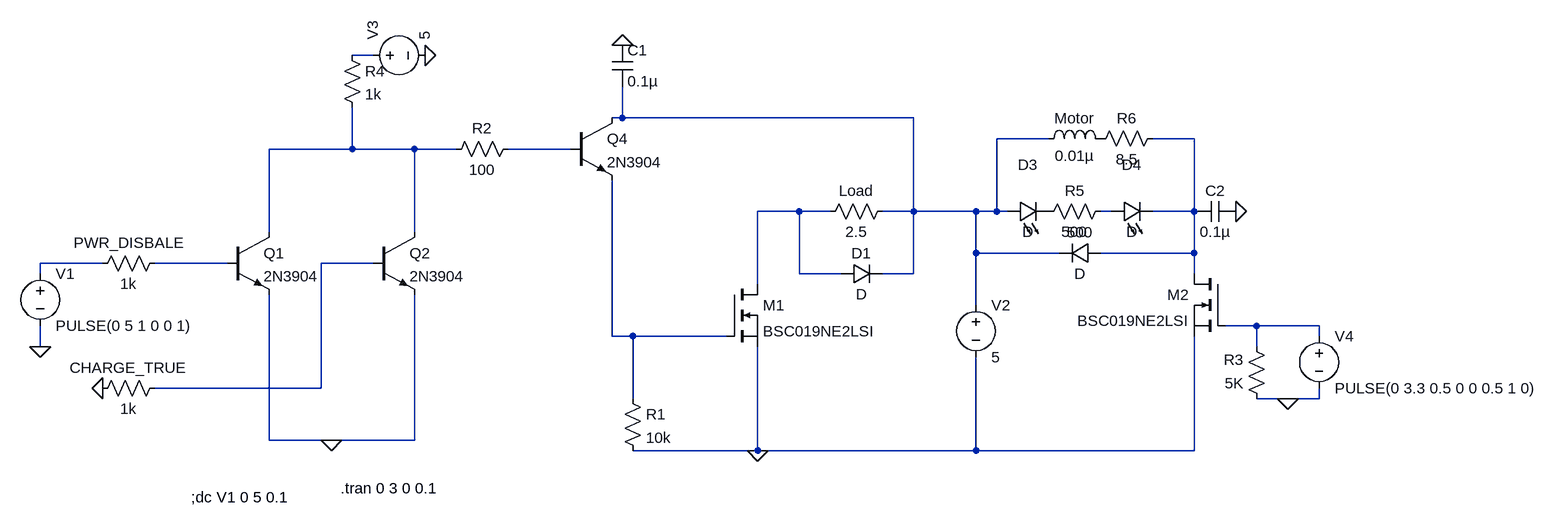
[diagram p0: schematic Control system simulation.asc]
Control system simulation.asc, the LTspice schematic file:
Version 4
SHEET 1 24240 680
WIRE -80 -416 -112 -416
WIRE 304 -320 304 -368
WIRE 304 -320 288 -320
WIRE 752 -320 304 -320
WIRE 960 -288 880 -288
WIRE 1184 -288 1120 -288
WIRE -112 -272 -112 -336
WIRE -112 -272 -240 -272
WIRE -16 -272 -112 -272
WIRE 48 -272 -16 -272
WIRE 224 -272 128 -272
WIRE 576 -176 512 -176
WIRE 624 -176 576 -176
WIRE 752 -176 752 -320
WIRE 752 -176 704 -176
WIRE 848 -176 752 -176
WIRE 880 -176 880 -288
WIRE 880 -176 848 -176
WIRE 896 -176 880 -176
WIRE 1056 -176 1040 -176
WIRE 1184 -176 1184 -288
WIRE 1184 -176 1120 -176
WIRE -240 -144 -240 -272
WIRE -16 -144 -16 -272
WIRE 848 -112 848 -176
WIRE 976 -112 848 -112
WIRE 1184 -112 1184 -176
WIRE 1184 -112 1040 -112
WIRE -496 -96 -592 -96
WIRE -304 -96 -416 -96
WIRE -80 -96 -160 -96
WIRE -592 -80 -592 -96
WIRE 576 -80 576 -176
WIRE 640 -80 576 -80
WIRE 752 -80 752 -176
WIRE 752 -80 704 -80
WIRE 1184 -80 1184 -112
WIRE 512 -64 512 -176
WIRE 848 -32 848 -112
WIRE 1280 0 1232 0
WIRE 1376 0 1280 0
WIRE 288 16 288 -224
WIRE 320 16 288 16
WIRE 464 16 320 16
WIRE 1376 16 1376 0
WIRE -592 32 -592 0
WIRE 1280 32 1280 0
WIRE -160 96 -160 -96
WIRE -160 96 -416 96
WIRE 320 112 320 16
WIRE 1328 112 1280 112
WIRE 1376 112 1376 96
WIRE 1376 112 1328 112
WIRE -240 176 -240 -48
WIRE -144 176 -240 176
WIRE -16 176 -16 -48
WIRE -16 176 -144 176
WIRE 512 192 512 32
WIRE 512 192 320 192
WIRE 848 192 848 48
WIRE 848 192 512 192
WIRE 1184 192 1184 16
WIRE 1184 192 848 192
FLAG 512 192 0
FLAG 304 -432 0
FLAG -144 176 0
FLAG 0 -416 0
FLAG -496 96 0
FLAG -592 32 0
FLAG 1248 -176 0
FLAG 1328 112 0
SYMBOL nmos 464 -64 R0
SYMATTR InstName M1
SYMATTR Value BSC019NE2LSI
SYMBOL voltage 848 -48 R0
WINDOW 123 0 0 Left 0
WINDOW 39 0 0 Left 0
SYMATTR InstName V2
SYMATTR Value 5
SYMBOL res 720 -192 R90
WINDOW 0 0 56 VBottom 2
WINDOW 3 32 56 VTop 2
SYMATTR InstName Load
SYMATTR Value 2.5
SYMBOL res 304 96 R0
SYMATTR InstName R1
SYMATTR Value 10k
SYMBOL diode 640 -64 R270
WINDOW 0 32 32 VTop 2
WINDOW 3 0 32 VBottom 2
SYMATTR InstName D1
SYMBOL cap 288 -432 R0
SYMATTR InstName C1
SYMATTR Value 0.1µ
SYMBOL npn -304 -144 R0
SYMATTR InstName Q1
SYMATTR Value 2N3904
SYMBOL npn -80 -144 R0
SYMATTR InstName Q2
SYMATTR Value 2N3904
SYMBOL res -400 80 R90
WINDOW 0 0 56 VBottom 2
WINDOW 3 32 56 VTop 2
SYMATTR InstName CHARGE_TRUE
SYMATTR Value 1k
SYMBOL res -400 -112 R90
WINDOW 0 0 56 VBottom 2
WINDOW 3 32 56 VTop 2
SYMATTR InstName PWR_DISBALE
SYMATTR Value 1k
SYMBOL voltage -96 -416 R270
WINDOW 123 0 0 Left 0
WINDOW 39 0 0 Left 0
SYMATTR InstName V3
SYMATTR Value 5
SYMBOL voltage -592 -96 R0
WINDOW 123 0 0 Left 0
WINDOW 39 0 0 Left 0
SYMATTR InstName V1
SYMATTR Value PULSE(0 5 1 0 0 1)
SYMBOL npn 224 -320 R0
SYMATTR InstName Q4
SYMATTR Value 2N3904
SYMBOL res 144 -288 R90
WINDOW 0 0 56 VBottom 2
WINDOW 3 32 56 VTop 2
SYMATTR InstName R2
SYMATTR Value 100
SYMBOL res -128 -432 R0
SYMATTR InstName R4
SYMATTR Value 1k
SYMBOL nmos 1232 -80 M0
SYMATTR InstName M2
SYMATTR Value BSC019NE2LSI
SYMBOL res 1296 128 R180
WINDOW 0 36 76 Left 2
WINDOW 3 36 40 Left 2
SYMATTR InstName R3
SYMATTR Value 5K
SYMBOL voltage 1376 0 R0
WINDOW 123 0 0 Left 0
WINDOW 39 0 0 Left 0
SYMATTR InstName V4
SYMATTR Value PULSE(0 3.3 0.5 0 0 0.5 1 0)
SYMBOL diode 1040 -128 R90
WINDOW 0 0 32 VBottom 2
WINDOW 3 32 32 VTop 2
SYMATTR InstName 500
SYMBOL LED 896 -160 R270
WINDOW 0 72 32 VTop 2
WINDOW 3 0 32 VBottom 2
SYMATTR InstName D3
SYMBOL LED 1056 -160 R270
WINDOW 0 72 32 VTop 2
WINDOW 3 0 32 VBottom 2
SYMATTR InstName D4
SYMBOL ind 944 -272 R270
WINDOW 0 32 56 VTop 2
WINDOW 3 5 56 VBottom 2
SYMATTR InstName Motor
SYMATTR Value 0.01µ
SYMBOL cap 1248 -192 R90
WINDOW 0 0 32 VBottom 2
WINDOW 3 32 32 VTop 2
SYMATTR InstName C2
SYMATTR Value 0.1µ
SYMBOL res 1056 -192 R90
WINDOW 0 0 56 VBottom 2
WINDOW 3 32 56 VTop 2
SYMATTR InstName R5
SYMATTR Value 500
SYMBOL res 1136 -304 R90
WINDOW 0 0 56 VBottom 2
WINDOW 3 32 56 VTop 2
SYMATTR InstName R6
SYMATTR Value 8.5
TEXT -130 250 Left 2 !.tran 0 3 0 0.1
TEXT -360 264 Left 2 !;dc V1 0 5 0.1

The netlist it stands for:
* Control system simulation.asc
M1 N006 N012 0 0 BSC019NE2LSI
V2 N002 0 5
R§Load N002 N006 2.5
R1 N012 0 10k
D1 N006 N002 D
C1 0 N002 0.1µ
Q1 N004 N009 0 0 2N3904
Q2 N004 N010 0 0 2N3904
R§CHARGE_TRUE N010 0 1k
R§PWR_DISBALE N009 N008 1k
V3 N001 0 5
V1 N008 0 PULSE(0 5 1 0 0 1)
Q4 N002 N005 N012 0 2N3904
R2 N005 N004 100
R4 N001 N004 1k
M2 N003 N011 0 0 BSC019NE2LSI
R3 0 N011 5K
V4 N011 0 PULSE(0 3.3 0.5 0 0 0.5 1 0)
D§500 N003 N002 D
D3 N002 P001 D
D4 N007 N003 D
L§Motor N002 P002 0.01µ
C2 0 N003 0.1µ
R5 N007 P001 500
R6 N003 P002 8.5
.model D D
.lib standard.dio
.model NPN NPN
.model PNP PNP
.lib standard.bjt
.model NMOS NMOS
.model PMOS PMOS
.lib standard.mos
.tran 0 3 0 0.1
;dc V1 0 5 0.1
.backanno
.end